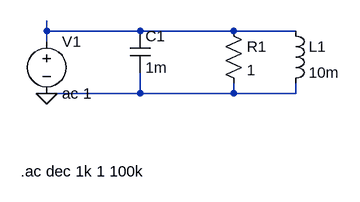
[diagram p0: schematic Draft4.asc]
Draft4.asc, the LTspice schematic file:
Version 4
SHEET 1 880 680
WIRE 0 224 0 208
WIRE 144 224 0 224
WIRE 288 224 144 224
WIRE 384 224 288 224
WIRE 0 240 0 224
WIRE 144 320 144 288
WIRE 144 320 0 320
WIRE 288 320 288 304
WIRE 288 320 144 320
WIRE 384 320 384 304
WIRE 384 320 288 320
FLAG 0 320 0
SYMBOL voltage 0 224 R0
SYMATTR InstName V1
SYMATTR Value ac 1
SYMATTR Value2 AC 5
SYMBOL cap 128 224 R0
SYMATTR InstName C1
SYMATTR Value 1m
SYMBOL res 272 208 R0
SYMATTR InstName R1
SYMATTR Value 1
SYMBOL ind 368 208 R0
SYMATTR InstName L1
SYMATTR Value 10m
TEXT -40 440 Left 2 !.ac dec 1k 1 100k

The netlist it stands for:
* Draft4.asc
V1 N001 0 ac 1 AC 5
C1 N001 0 1m
R1 N001 0 1
L1 N001 0 10m
.ac dec 1k 1 100k
.backanno
.end